# Altium schematic sheet Ethernet.SchDoc
size 420 x 297 mm; SheetNumber: 15; SheetTotal: 32; DocumentTypeShort: Э3; DocumentInvertoryNumber: ㅤ
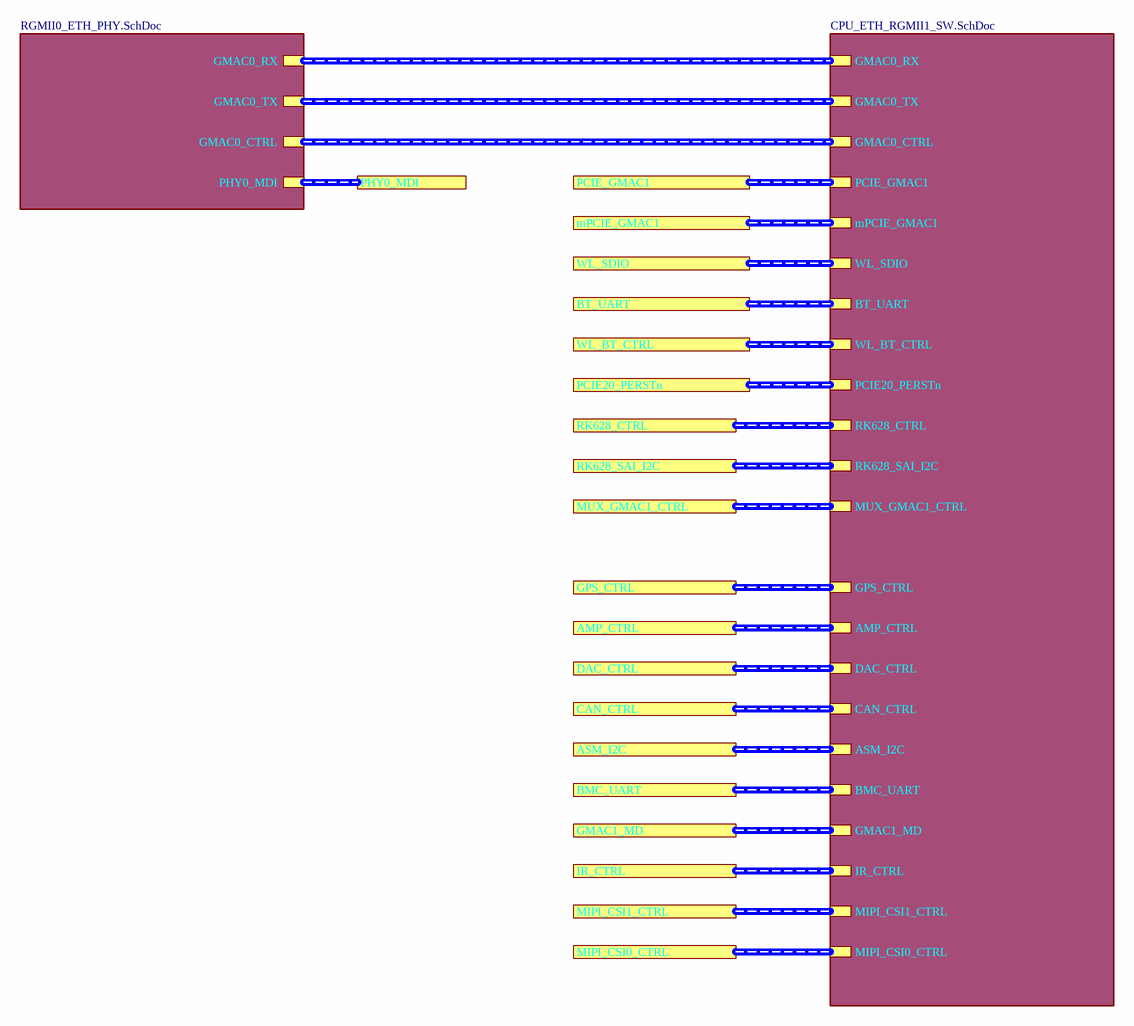
[diagram p0: Ethernet.SchDoc]

## Sub-sheets
CPU_ETH_RGMII1_SW = CPU_ETH_RGMII1_SW.SchDoc: GMAC0_RX (harness GMAC0_RX), GMAC0_TX (harness GMAC0_TX), GMAC0_CTRL (harness GMAC0_CTRL), PCIE_GMAC1 (harness PCIE_GMAC1), mPCIE_GMAC1 (harness mPCIE_GMAC1), WL_SDIO (harness WL_SDIO), BT_UART (harness BT_UART), WL_BT_CTRL (harness WL_BT_CTRL), RK628_SAI_I2C (harness RK628_SAI_I2C), RK628_CTRL (harness RK628_CTRL), MUX_GMAC1_CTRL (harness MUX_GMAC1_CTRL), GPS_CTRL (harness GPS_CTRL), AMP_CTRL (harness AMP_CTRL), DAC_CTRL (harness DAC_CTRL), CAN_CTRL (harness CAN_CTRL), ASM_I2C (harness ASM_I2C), BMC_UART (harness BMC_UART), GMAC1_MD (harness GMAC1_MD), PCIE20_PERSTn (harness PCIE20_PERSTn), IR_CTRL (harness IR_CTRL), MIPI_CSI1_CTRL (harness MIPI_CSI1_CTRL), MIPI_CSI0_CTRL (harness MIPI_CSI0_CTRL)
RGMII0_ETH_PHY = RGMII0_ETH_PHY.SchDoc: GMAC0_RX (harness GMAC0_RX), GMAC0_TX (harness GMAC0_TX), GMAC0_CTRL (harness GMAC0_CTRL), PHY0_MDI (harness PHY0_MDI)

## Ports
AMP_CTRL, ASM_I2C, BMC_UART, BT_UART, CAN_CTRL, DAC_CTRL, GMAC1_MD, GPS_CTRL, IR_CTRL, MIPI_CSI0_CTRL, MIPI_CSI1_CTRL, mPCIE_GMAC1, MUX_GMAC1_CTRL, PCIE20_PERSTn, PCIE_GMAC1, PHY0_MDI, RK628_CTRL, RK628_SAI_I2C, WL_BT_CTRL, WL_SDIO

## Buses and harness runs
harness port AMP_CTRL = sheet CPU_ETH_RGMII1_SW/AMP_CTRL
harness port ASM_I2C = sheet CPU_ETH_RGMII1_SW/ASM_I2C
harness port BMC_UART = sheet CPU_ETH_RGMII1_SW/BMC_UART
harness port BT_UART = sheet CPU_ETH_RGMII1_SW/BT_UART
harness port CAN_CTRL = sheet CPU_ETH_RGMII1_SW/CAN_CTRL
harness port DAC_CTRL = sheet CPU_ETH_RGMII1_SW/DAC_CTRL
harness port GMAC1_MD = sheet CPU_ETH_RGMII1_SW/GMAC1_MD
harness port GPS_CTRL = sheet CPU_ETH_RGMII1_SW/GPS_CTRL
harness port IR_CTRL = sheet CPU_ETH_RGMII1_SW/IR_CTRL
harness port MIPI_CSI0_CTRL = sheet CPU_ETH_RGMII1_SW/MIPI_CSI0_CTRL
harness port MIPI_CSI1_CTRL = sheet CPU_ETH_RGMII1_SW/MIPI_CSI1_CTRL
harness port mPCIE_GMAC1 = sheet CPU_ETH_RGMII1_SW/mPCIE_GMAC1
harness port MUX_GMAC1_CTRL = sheet CPU_ETH_RGMII1_SW/MUX_GMAC1_CTRL
harness port PCIE20_PERSTn = sheet CPU_ETH_RGMII1_SW/PCIE20_PERSTn
harness port PCIE_GMAC1 = sheet CPU_ETH_RGMII1_SW/PCIE_GMAC1
harness port PHY0_MDI = sheet RGMII0_ETH_PHY/PHY0_MDI
harness port RK628_CTRL = sheet CPU_ETH_RGMII1_SW/RK628_CTRL
harness port RK628_SAI_I2C = sheet CPU_ETH_RGMII1_SW/RK628_SAI_I2C
harness port WL_BT_CTRL = sheet CPU_ETH_RGMII1_SW/WL_BT_CTRL
harness port WL_SDIO = sheet CPU_ETH_RGMII1_SW/WL_SDIO
harness sheet CPU_ETH_RGMII1_SW/GMAC0_CTRL = sheet RGMII0_ETH_PHY/GMAC0_CTRL
harness sheet CPU_ETH_RGMII1_SW/GMAC0_RX = sheet RGMII0_ETH_PHY/GMAC0_RX
harness sheet CPU_ETH_RGMII1_SW/GMAC0_TX = sheet RGMII0_ETH_PHY/GMAC0_TX

## Notes on the sheet
- Подп. и дата
- Инв. № дубл.
- Взам. инв. №
- Инв. № подл.
- Изм.
- Лист
- № докум.
- Подп.
- Дата
- Копировал
- Формат А3